# EAGLE design 14DoF MPU9150 ADXL375 (EAGLE 6.2)
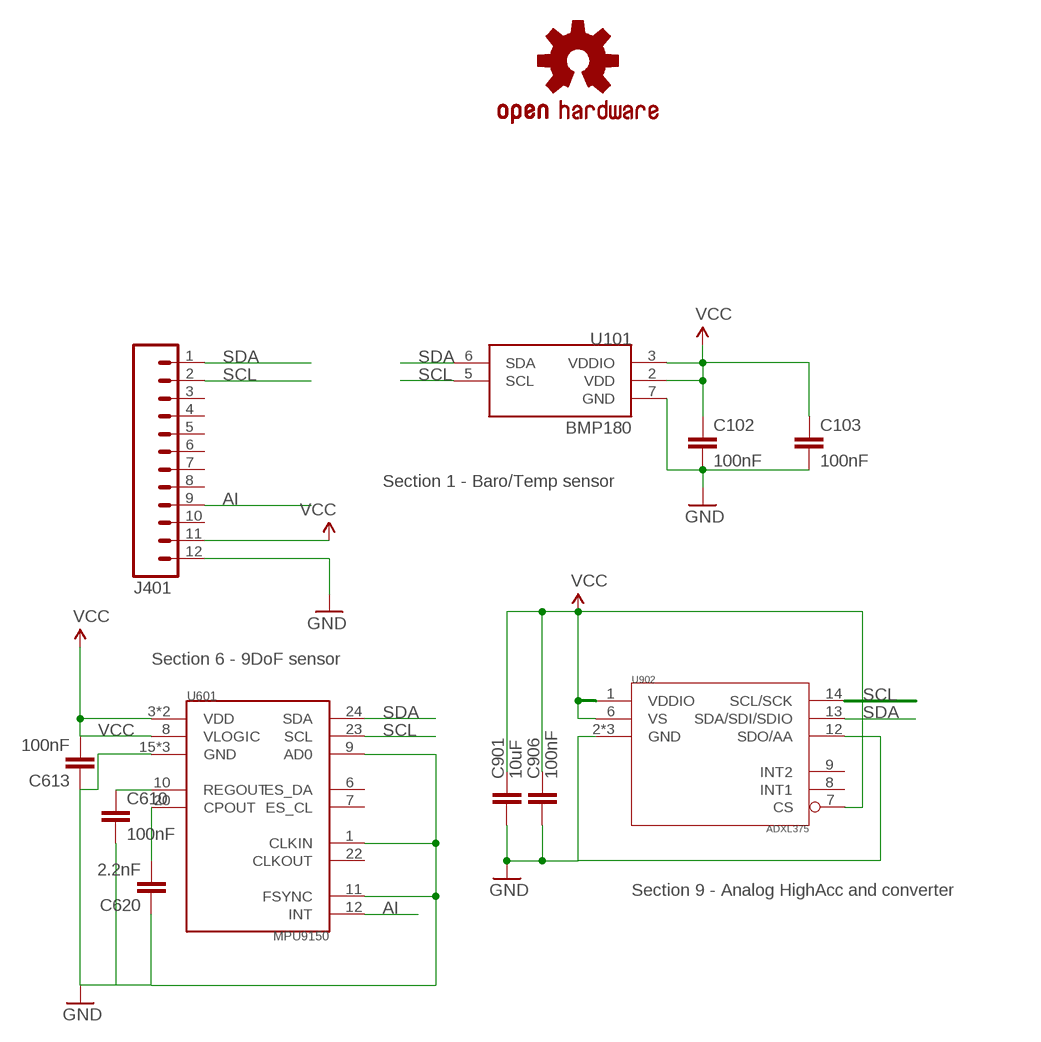
[diagram p0: schematic, sheet 1]

## Parts
C102  100nF  CAP0603-CAP  [0603-CAP]
C103  100nF  CAP0603-CAP  [0603-CAP]
C610  100nF  CAP0603-CAP  [0603-CAP]
C613  100nF  CAP0603-CAP  [0603-CAP]
C620  2.2nF  CAP0603-CAP  [0603-CAP]
C901  10uF  CAP0603-CAP  [0603-CAP]
C906  100nF  CAP0603-CAP  [0603-CAP]
J401  M12PTH  [1X12]
U101  BMP180  [BMP180]
U601  MPU9150  [LLGA24]
U902  ADXL375  [ADXL375]
U$2  OSHW-LOGOS  [OSHW-LOGO-S]

## Nets
AI: J401.9 U601.12(INT)
GND: C102.2 C103.2 C610.2 C613.1 C620.1 C901.2 C906.2 J401.12 U101.7(GND) U601.1(CLKIN) U601.9(AD0) U601.11(FSYNC) U601.15(GND) U601.17(GND) U601.18(GND) U902.2(GND) U902.4(GND) U902.5(GND) U902.12(SDO/AA)
N$1: C610.1 U601.10(REGOUT)
N$3: C620.2 U601.20(CPOUT)
SCL: J401.2 U101.5(SCL) U601.23(SCL) U902.14(SCL/SCK)
SDA: J401.1 U101.6(SDA) U601.24(SDA) U902.13(SDA/SDI/SDIO)
VCC [POWER]: C102.1 C103.1 C613.2 C901.1 C906.1 J401.11 U101.2(VDD) U101.3(VDDIO) U601.3(VDD) U601.8(VLOGIC) U601.13(VDD) U902.1(VDDIO) U902.6(VS)
Unconnected: J401.3 J401.4 J401.5 J401.6 J401.7 J401.8 J401.10 U601.6(ES_DA) U601.7(ES_CL) U601.22(CLKOUT) U902.7(CS) U902.8(INT1) U902.9(INT2)

## Notes on the sheet
- Section 1 - Baro/Temp sensor
- Section 6 - 9DoF sensor
- Section 9 - Analog HighAcc and converter

## Library data of the parts
C102 C103 C610 C613 C906 = SparkFun:CAP: Capacitor Standard 0603 ceramic capacitor, and 0.1" leaded capacitor.; DIGIKEY: 445-1317-2-ND
C620 = SparkFun:CAP: Capacitor Standard 0603 ceramic capacitor, and 0.1" leaded capacitor.; DIGIKEY: 445-1309-2-ND
C901 = SparkFun:CAP: Capacitor Standard 0603 ceramic capacitor, and 0.1" leaded capacitor.; DIGIKEY: 445-7486-1-ND
J401 = SparkFun:M12: Header 12 Standard 12-pin 0.1" header. Use with straight break away headers (SKU : PRT-00116), right angle break away headers (PRT-00553), swiss pins (PRT-00743), machine pins (PRT-00117), and female headers (PRT-00115).; DIGIKEY: $NOPART
U101 = KwanSystems:BMP180; DIGIKEY: 828-1027-1-ND
U601 = KwanSystems:MPU9150
U902 = KwanSystems:ADXL375
U$2 = SparkFun:OSHW-LOGO: Open Source Hardware Logo This logo indicates the piece of hardware it is found on incorporates a OSHW license and/or adheres to the definition of open source hardware found here: http://freedomdefined.org/OSHW; DIGIKEY: $NOPART

## Net classes
0 default: width 0.152 mm, drill 0.33 mm, clearance 0.152 mm
1 POWER: width 0.152 mm, drill 0.33 mm, clearance 0.152 mm
2 hv: width 0.152 mm, drill 0.33 mm, clearance 0.152 mm

## Board
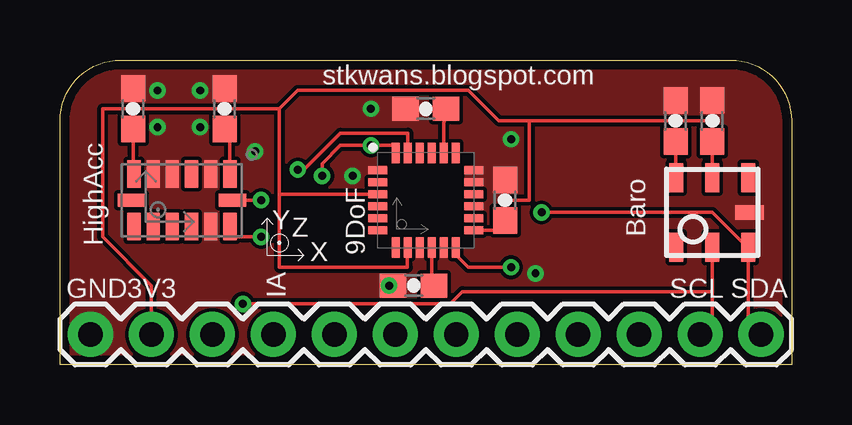
[diagram p1: board, top side]
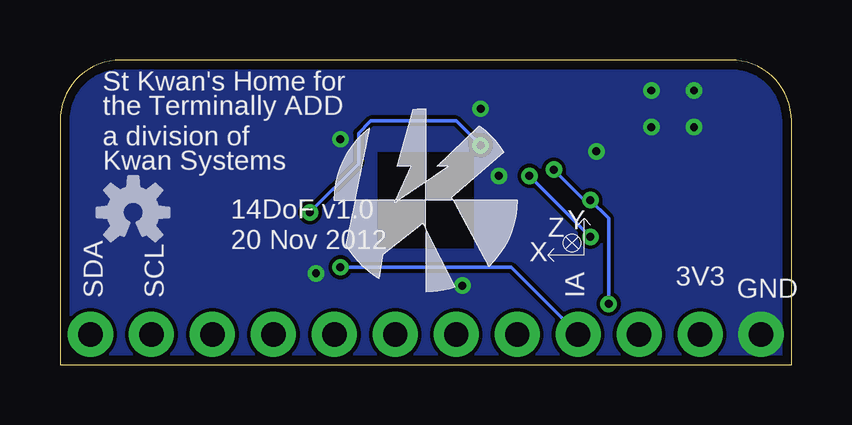
[diagram p2: board, bottom side, seen from below]

Size 30.48 x 12.7 mm. Coordinates in mm from the lower left corner, seen from the top.
Outline: 0,0 0,10.16 arc-90 2.54,12.7 27.94,12.7 arc-90 30.48,10.16 30.48,0 0,0
Copper layers (1*16): Top 0.0356mm / dielectric 1.5011mm / Bottom 0.0356mm
Design rules: minimum track width 6mil, minimum drill 13mil, track to track 6mil, track to pad 6mil, pad to pad 6mil, via to via 6mil, smd to smd 6mil, copper to edge 15mil, drill to drill 6mil, minimum pad ring 7mil, minimum via ring 7mil, stop-mask expansion 4mil, vias tented up to drill 14mil, thermal gap 10mil
vRestrict: area 0.8,2.8 to 1.8,4.8; area 3.3,2.8 to 4.3,4.8; area 5.8,2.8 to 6.9,4.8; area 8.4,2.8 to 9.4,3.8; area 10.9,2.8 to 11.7,5.3; area 12.7,2.8 to 15.2,3.6; area 13.5,3.6 to 14.2,5.3; area 15.5,2.8 to 18,3.6; area 18.5,2.8 to 19.6,3.8; area 20.6,2.8 to 22.6,3.6; area 21.1,3.6 to 21.8,4.8; area 23.6,2.8 to 24.4,3.8; 19 more areas

### Footprints (pad centres in the part's own frame; a part is rotated, then mirrored left to right if it is on the bottom)
0603-CAP = smd 1.1 x 1: 1 -0.85,0; 2 0.85,0
1X12 = drill 1.016 pad 1.88: 1 0,0; 2 2.54,0; 3 5.08,0; 4 7.62,0; 5 10.16,0; 6 12.7,0; 7 15.24,0; 8 17.78,0; 9 20.32,0; 10 22.86,0; 11 25.4,0; 12 27.94,0
BMP180 = smd 0.6 x 1.2: 1 1.5,1.45; 2 0,1.45; 3 -1.5,1.45; 4 -1.5,-1.45; 5 0,-1.45; 6 1.5,-1.45 | smd 1.2 x 0.6: 7 1.55,0
LLGA24 = smd 0.8 x 0.35: 1 -2,1.25; 2 -2,0.75; 3 -2,0.25; 4 -2,-0.25; 5 -2,-0.75; 6 -2,-1.25; 13 2,-1.25; 14 2,-0.75; 15 2,-0.25; 16 2,0.25; 17 2,0.75; 18 2,1.25 | smd 0.35 x 0.85: 7 -1.25,-1.975; 8 -0.75,-1.975; 9 -0.25,-1.975; 10 0.25,-1.975; 11 0.75,-1.975; 12 1.25,-1.975; 19 1.25,1.975; 20 0.75,1.975; 21 0.25,1.975; 22 -0.25,1.975; 23 -0.75,1.975; 24 -1.25,1.975
ADXL375 = smd 0.55 x 1.145: 1 2,1.097; 2 1.2,1.097; 3 0.4,1.097; 4 -0.4,1.097; 5 -1.2,1.097; 6 -2,1.097; 8 -2,-1.097; 9 -1.2,-1.097; 10 -0.4,-1.097; 11 0.4,-1.097; 12 1.2,-1.097; 13 2,-1.097 | smd 1.145 x 0.55: 7 -2.098,0; 14 2.098,0

### Placement (x,y rotation side)
C102  27.18,10.16 90 top
C103  25.65,10.16 90 top
C610  14.73,3.3 180 top
C613  18.54,6.86 270 top
C620  15.24,10.67 0 top
C901  6.86,10.67 90 top
C906  3.05,10.67 90 top
J401  29.21,1.27 180 top
U101  27.18,6.35 0 top
U601  15.24,6.86 0 top
U902  5.08,6.86 0 top
U$1  [KWAN_ACC]  15.24,6.86 0 bottom
U$2  27.43,6.35 0 bottom
U$3  [AXES_SM]  8.64,4.57 0 top

### Tracks (layer width: path | path; a pad name or v marks a point on that pad's centre or on a via)
AI  (via drill 0.33)
  Top 0.152: U601.12 16.49,4.59 17.02,4.06 v18.8,4.06
  Bottom 0.152: v18.8,4.06 11.68,4.06 J401.9
GND  (via drill 0.33)
  other vias: 4.06,11.43 5.84,11.43 4.06,9.91 5.84,9.91 8.13,8.89 18.8,9.4 12.19,7.87 12.95,10.67 19.81,3.81 13.72,3.3
  pour Top (no thermals): 2.54,12.7 27.94,12.7 arc-90 30.48,10.16 30.48,0 0,0 0,10.16 arc-90
  pour Bottom (no thermals): 2.54,12.7 27.94,12.7 arc-90 30.48,10.16 30.48,0 0,0 0,10.16 arc-90
N$1
  Top 0.152: C610.1 15.49,3.3 15.49,4.83 U601.10
N$3
  Top 0.152: U601.20 15.99,10.06 C620.2
SCL  (via drill 0.33)
  Top 0.152: J401.2 27.18,1.78 27.18,3.05 | 27.18,3.05 U101.5 | v9.91,8.13 10.16,8.13 11.68,9.65 14.49,9.65 U601.23 | U902.14 v8.38,6.86 | 27.18,3.05 16.76,3.05 16.26,2.54 v7.62,2.54
  Bottom 0.152: v9.91,8.13 8.64,6.86 v8.38,6.86 7.62,6.1 v7.62,2.54
SDA  (via drill 0.33)
  Top 0.152: J401.1 28.68,1.8 U101.6 28.45,5.08 27.18,6.35 v20.07,6.35 | v10.92,7.87 10.92,8.38 11.68,9.14 v12.95,9.14 13.97,9.14 13.97,8.89 U601.24 | v8.38,5.33 7.11,5.33 7.11,5.73 U902.13
  Bottom 0.152: v8.38,5.33 v10.92,7.87 | v20.07,6.35 18.03,8.38 18.03,9.65 17.53,10.16 13.97,10.16 v12.95,9.14
VCC
  Top 0.152: J401.11 3.81,3.3 1.78,5.33 1.78,10.67 3.05,10.67 | 3.05,10.67 6.86,10.67 | 6.86,10.67 9.14,10.67 | 9.14,10.67 9.91,11.43 17.02,11.43 18.29,10.16 19.56,10.16 | 19.56,10.16 25.65,10.16 | 25.65,10.16 27.18,10.16 C102.1 U101.2 | 25.65,10.16 C103.1 25.65,7.82 U101.3 | 3.05,10.67 C906.1 3.05,7.99 U902.6 | 6.86,10.67 C901.1 7.08,9.82 U902.1 | U601.13 18.54,5.61 C613.2 18.54,6.86 19.56,6.86 19.56,10.16 | 9.14,10.67 9.14,7.11 | 9.14,7.11 9.14,4.06 14.48,4.06 14.48,4.88 U601.8 | U601.3 9.14,7.11

### Text on the board
tPlace: stkwans.blogspot.com | HighAcc | 9DoF | Baro | GND | 3V3 | IA | SCL | SDA
bPlace: St Kwan's Home for | the Terminally ADD | a division of | Kwan Systems | 14DoF v1.0 | 20 Nov 2012 | GND | 3V3 | IA | SCL | SDA